# EAGLE schematic TA_590_mock_sch (EAGLE 9.2.1)
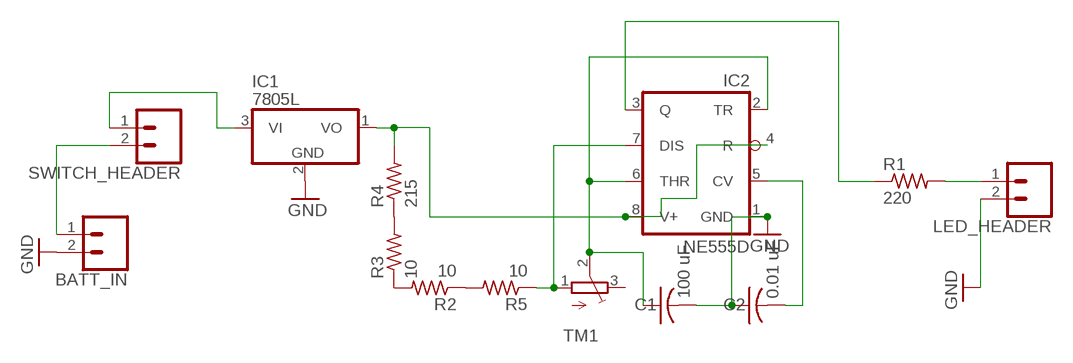
[diagram p0: schematic, sheet 1]

## Parts
BATT_IN  CONN_02  [1X02]
C1  100 uF  C-USC0805  [C0805]
C2  0.01 uF  C-USC0805  [C0805]
IC1  7805L  [TO92]
IC2  NE555D  [SO08]
LED_HEADER  CONN_02  [1X02]
R1  220  R-US_R0805  [R0805]
R2  10  R-US_R0805  [R0805]
R3  10  R-US_R0805  [R0805]
R4  215  R-US_R0805  [R0805]
R5  10  R-US_R0805  [R0805]
SWITCH_HEADER  CONN_02  [1X02]
TM1  TRIMPOTTC33X  [TC33X]

## Nets
GND: BATT_IN.2 C1.2 C2.1 IC1.2(GND) IC2.1(GND) LED_HEADER.2
N$1: BATT_IN.1 SWITCH_HEADER.2
N$2: IC1.3(VI) SWITCH_HEADER.1
N$3: R2.1 R5.2
N$4: R3.2 R4.1
N$5: R2.2 R3.1
N$6: IC2.3(Q) R1.1
N$7: IC2.7(DIS) R5.1 TM1.1(A)
N$8: C1.1 IC2.2(TR) IC2.6(THR) TM1.2(S)
N$10: C2.2 IC2.5(CV)
N$11: LED_HEADER.1 R1.2
PWR: IC1.1(VO) IC2.4(R) IC2.8(V+) R4.2
Unconnected: TM1.3(E)

## Library data of the parts
BATT_IN LED_HEADER SWITCH_HEADER = SparkFun-Connectors:CONN_02: Multi connection point. Often used as Generic Header-pin footprint for 0.1 inch spaced/style header connections On any of the 0.1 inch spaced packages, you can populate with these: Break Away Headers - Straight <https://www.sparkfun.com/products/116> (PRT-00116) Break Away Male Headers - Right Angle <https://www.sparkfun.com/products/553> (PRT-00553) Female Headers <https://www.sparkfun.com/products/115> (PRT-00115) Break Away Headers - Machine Pin <https://www.sparkfun.com/products/117> (PRT-00117) Break Away Female Headers - Swiss Machine Pin <https://www.sparkfun.com/products/743> (PRT-00743) For SCREWTERMINALS and SPRING TERMINALS visit here: Screw Terimnals on SparkFun.com <https://www.sparkfun.com/search/results?term=Screw+Terminals> (5mm/3.5mm/2.54mm spacing) This device is also useful as a general connection point to wire up your design to another part of your project. Our various solder wires solder well into these plated through hole pads. Hook-Up Wire - Assortment (Stranded, 22 AWG) <https://www.sparkfun.com/products/11375> (PRT-11375) Hook-Up Wire - Assortment (Solid Core, 22 AWG) <https://www.sparkfun.com/products/11367> (PRT-11367) View the entire wire category on our website here <https://www.sparkfun.com/categories/141> Special notes: Molex polarized connector foot print use with: PRT-08233 with associated crimp pins and housings. 2.54_SCREWTERM for use with PRT-10571. 3.5mm Screw Terminal footprints for PRT-08084 5mm Screw Terminal footprints for use with PRT-08432
C1 C2 = adafruit:C-US: CAPACITOR, American symbol
IC1 = adafruit:78*: Positive VOLTAGE REGULATOR Added bigger pads to the TO-92 package
IC2 = adafruit:*555: TIMER Changed DIP package to have round (not oval) pin pads http://www.ladyada.net/library/pcb/eaglelibrary.html
R1-R5 = adafruit:R-US_: RESISTOR, American symbol
TM1 = adafruit:TRIMPOT: SMT trimmer potentiometer part number TC33X http://www.ladyada.net/library/eagle

## Net classes
0 default: clearance 0.254 mm